# Altium project LDM_POWER_PCB.PrjPcb
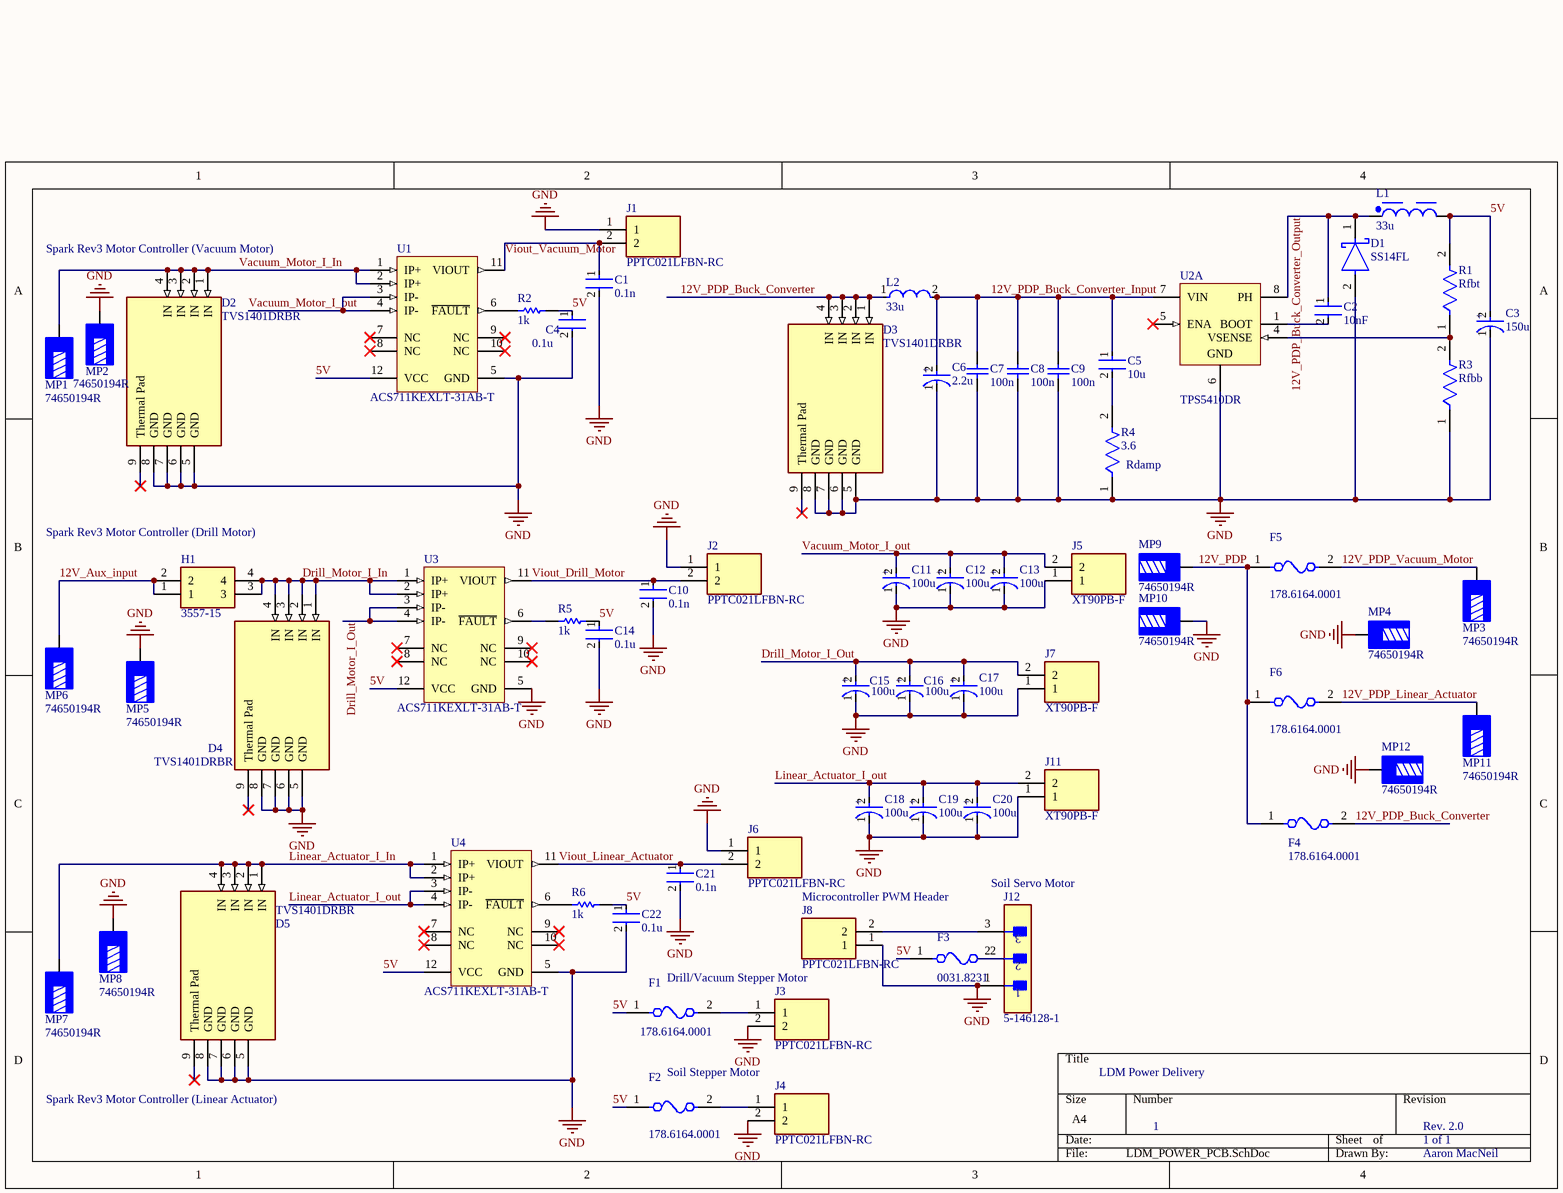
[diagram p0: LDM_POWER_PCB.SchDoc]
1 sheet, 68 parts. Net scope: global (net labels, ports and power ports of the same name join across sheets).
Board file: LDM_POWER_PCB.PcbDoc

## Sheet LDM_POWER_PCB.SchDoc
size A4; SheetNumber: 1; SheetTotal: 1

### Parts
C1  0.1n  [FP-GCM155-0_05-IPC_C]
C2  10nF  [FP-0805-L_2_01_0_2-W_1_25-IPC_A]
C3  150u  [FP-POSCAP-B15G-MFG]
C4  0.1u  [FP-GRM033-0_03-MFG]
C5  10u  [FP-GRM31C-0_2-e0_3_0_8-MFG]
C6  2.2u  [FP-TAJT-MFG]
C7  100n  [CAPC2013X145X48NL20T23]
C8  100n  [CAPC2013X145X48NL20T23]
C9  100n  [CAPC2013X145X48NL20T23]
C10  0.1n  [FP-GCM155-0_05-IPC_C]
C11  100u  [FP-A700X107M12RATE012-MFG]
C12  100u  [FP-A700X107M12RATE012-MFG]
C13  100u  [FP-A700X107M12RATE012-MFG]
C14  0.1u  [FP-GRM033-0_03-MFG]
C15  100u  [FP-A700X107M12RATE012-MFG]
C16  100u  [FP-A700X107M12RATE012-MFG]
C17  100u  [FP-A700X107M12RATE012-MFG]
C18  100u  [FP-A700X107M12RATE012-MFG]
C19  100u  [FP-A700X107M12RATE012-MFG]
C20  100u  [FP-A700X107M12RATE012-MFG]
C21  0.1n  [FP-GCM155-0_05-IPC_C]
C22  0.1u  [FP-GRM033-0_03-MFG]
D1  SS14FL  [FP-425AD-MFG]
D2  TVS1401DRBR  [FP-DRB0008A-MFG]
D3  TVS1401DRBR  [FP-DRB0008A-MFG]
D4  TVS1401DRBR  [FP-DRB0008A-MFG]
D5  TVS1401DRBR  [FP-DRB0008A-MFG]
F1  178.6164.0001  [FP-178_6164_0001-MFG]
F2  178.6164.0001  [FP-178_6164_0001-MFG]
F3  0031.8231  [FP-0031_8231-MFG]
F4  178.6164.0001  [FP-178_6164_0001-MFG]
F5  178.6164.0001  [FP-178_6164_0001-MFG]
F6  178.6164.0001  [FP-178_6164_0001-MFG]
H1  3557-15  [355715]
J1  PPTC021LFBN-RC  [RHDR2W80P0X254_1X2_558X254X850P]
J2  PPTC021LFBN-RC  [RHDR2W80P0X254_1X2_558X254X850P]
J3  PPTC021LFBN-RC  [RHDR2W80P0X254_1X2_558X254X850P]
J4  PPTC021LFBN-RC  [RHDR2W80P0X254_1X2_558X254X850P]
J5  XT90PB-F  [XT90PBF]
J6  PPTC021LFBN-RC  [RHDR2W80P0X254_1X2_558X254X850P]
J7  XT90PB-F  [XT90PBF]
J8  PPTC021LFBN-RC  [RHDR2W80P0X254_1X2_558X254X850P]
J11  XT90PB-F  [XT90PBF]
J12  5-146128-1  [FP-5-146128-1-MFG]
L1  33u  [WE-LQS_6045]
L2  33u  [FP-NR6028-MFG]
MP1  74650194R  [74650194]
MP2  74650194R  [74650194]
MP3  74650194R  [74650194]
MP4  74650194R  [74650194]
MP5  74650194R  [74650194]
MP6  74650194R  [74650194]
MP7  74650194R  [74650194]
MP8  74650194R  [74650194]
MP9  74650194R  [74650194]
MP10  74650194R  [74650194]
MP11  74650194R  [74650194]
MP12  74650194R  [74650194]
R1  Rfbt  [FP-CRCW0402-e3-IPC_B]
R2  1k  [RESC1608X55X30LL15T15]
R3  Rfbb  [FP-CRCW0402-e3-MFG]
R4  3.6  [FP-ESR10-IPC_A]
R5  1k  [RESC1608X55X30LL15T15]
R6  1k  [RESC1608X55X30LL15T15]
U1  ACS711KEXLT-31AB-T  [ALEG-EX-12_V]
U2  TPS5410DR  [D0008A_L]  (part A of 2)
U3  ACS711KEXLT-31AB-T  [ALEG-EX-12_V]
U4  ACS711KEXLT-31AB-T  [ALEG-EX-12_V]

### Nets
GND: C1.2 C3.1(C) C4.2 C6.1(C) C7.1 C8.1 C9.1 C10.2 C11.1(C) C12.1(C) C13.1(C) C14.2 C15.1(C) C16.1(C) C17.1(C) C18.1(C) C19.1(C) C20.1(C) C21.2 C22.2 D1.2(A) D2.5(GND) D2.6(GND) D2.7(GND) D2.8(GND) D3.5(GND) D3.6(GND) D3.7(GND) D3.8(GND) D4.5(GND) D4.6(GND) D4.7(GND) D4.8(GND) D5.5(GND) D5.6(GND) D5.7(GND) D5.8(GND) J1.1 J2.1 J3.2 J4.2 J5.1 J6.1 J7.1 J8.1 J11.1 J12.1 MP2.1 MP4.1 MP5.1 MP8.1 MP10.1 MP12.1 R3.1 R4.1 U1.5(GND) U2.6(GND) U3.5(GND) U4.5(GND)
5V: C3.2(A) C4.1 C14.1 C22.1 F1.1 F2.1 F3.1 L1.2 R1.2 R2.2 R5.2 R6.2 U1.12(VCC) U3.12(VCC) U4.12(VCC)
12V_Aux_input: H1.1 H1.2 MP6.1
12V_PDP: F4.1 F5.1 F6.1 MP9.1
12V_PDP_Buck_Converter: D3.1(IN) D3.2(IN) D3.3(IN) D3.4(IN) F4.2 L2.1
12V_PDP_Buck_Converter_Input: C5.1 C6.2(A) C7.2 C8.2 C9.2 L2.2 U2.7(VIN)
12V_PDP_Buck_Converter_Output: C2.1 D1.1(C) L1.1 U2.8(PH)
12V_PDP_Linear_Actuator: F6.2 MP11.1
12V_PDP_Vacuum_Motor: F5.2 MP3.1
Drill_Motor_I_In: D4.1(IN) D4.2(IN) D4.3(IN) D4.4(IN) H1.3 H1.4 U3.1(IP+) U3.2(IP+)
Drill_Motor_I_Out: C15.2(A) C16.2(A) C17.2(A) J7.2 U3.3(IP-) U3.4(IP-)
Linear_Actuator_I_In: D5.1(IN) D5.2(IN) D5.3(IN) D5.4(IN) MP7.1 U4.1(IP+) U4.2(IP+)
Linear_Actuator_I_out: C18.2(A) C19.2(A) C20.2(A) J11.2 U4.3(IP-) U4.4(IP-)
Vacuum_Motor_I_In: D2.1(IN) D2.2(IN) D2.3(IN) D2.4(IN) MP1.1 U1.1(IP+) U1.2(IP+)
Vacuum_Motor_I_out: C11.2(A) C12.2(A) C13.2(A) J5.2 U1.3(IP-) U1.4(IP-)
Viout_Drill_Motor: C10.1 J2.2 U3.11(VIOUT)
Viout_Linear_Actuator: C21.1 J6.2 U4.11(VIOUT)
Viout_Vacuum_Motor: C1.1 J1.2 U1.11(VIOUT)
NetC2_2: C2.2 U2.1(BOOT)
NetC5_2: C5.2 R4.2
NetF1_2: F1.2 J3.1
NetF2_2: F2.2 J4.1
NetF3_2: F3.2 J12.2
NetJ8_2: J8.2 J12.3
NetR1_1: R1.1 R3.2 U2.4(VSENSE)
NetR2_1: R2.1 U1.6(~{FAULT})
NetR5_1: R5.1 U3.6(~{FAULT})
NetR6_1: R6.1 U4.6(~{FAULT})

Not connected (* = marked no-connect by the designer): D2 9(Thermal_Pad)*; D3 9(Thermal_Pad)*; D4 9(Thermal_Pad)*; D5 9(Thermal_Pad)*; U1 7(NC)* 8(NC)* 9(NC)* 10(NC)*; U2 5(ENA)*; U3 7(NC)* 8(NC)* 9(NC)* 10(NC)*; U4 7(NC)* 8(NC)* 9(NC)* 10(NC)*

### Notes on the sheet
- (near D2) Spark Rev3 Motor Controller (Vacuum Motor)
- (near R4) Rdamp
- (near H1) Spark Rev3 Motor Controller (Drill Motor)
- (near J8) Microcontroller PWM Header
- (near J12) Soil Servo Motor
- Drill/Vacuum Stepper Motor
- Soil Stepper Motor
- LDM Power Delivery
- Spark Rev3 Motor Controller (Linear Actuator)
- 1
- Rev. 2.0
- 1 of 1
- Aaron MacNeil
- (in symbol CMP-03016-000017-1) +
- (in symbol CMP-04424-000626-1) +
- (in symbol CMP-05428-000197-1) +

### Library data of the parts
C1 C10 C21 = CMP-2008-03694-3: Ceramic Capacitor for Automotive 100pF ±5% 50VDC C0G 0402 Paper T/R; Voltage: 50V; Ratings: AEC-Q200; Radiation Hardening: No; Min Operating Temperature: -55°C; Capacitance: 100pF; Depth: 0.5mm; Max Operating Temperature: 125°C; Length: 1mm; Height: 0.5mm; Termination: SMD/SMT; Voltage Rating: 50V; Dielectric: C0G; Package Quantity: 10000; Case Code (Imperial): 0402; Width: 0.02inch; Case/Package: 0402; Lead Free: Lead Free; Case Code (Metric): 1005; Voltage Rating (DC): 50V; Thickness: 0.022inch; Mount: Surface Mount; Tolerance: 5%; REACH SVHC: No SVHC; Weight: 0.000212oz; Packaging: Tape and Reel
C2 = CMP-2000-05015-2: General Purpose Ceramic Capacitor, 0805, 10nF, 10%, X7R, 0.15, 50V; Dissipation Factor: 2.5%; Insulation Resistance: 100GR; Capacitance: 10nF; Case/Package: 0805; Tolerance: 10%; Number of Pins: 2; Thickness: 0.037inch; RoHS Compliant: Yes; Width: 1.25mm; Voltage: 50V; Lead Free: Lead Free; Voltage Rating: 50V; Termination: SMD/SMT; Dielectric Material: Ceramic; Dielectric: X7R; Radiation Hardening: No; Package Quantity: 1; Case Code (Metric): 2012; Max Operating Temperature: 125°C; Voltage Rating (DC): 50V; Depth: 1.25mm; REACH SVHC: No SVHC; Case Code (Imperial): 0805; Min Operating Temperature: -55°C; Packaging: Tape and Reel; Mount: Surface Mount; Length: 2.01mm; Height: 0.94mm; Contact Plating: Tin
C3 = CMP-05428-000197-1: Molded Tantalum Polymer Capacitor 150uF 20% 6.3V life 1000Hours SMD 1411; Leakage Current: 94.5uA; Dissipation Factor: 10%; Polarity: Polar; ESR (Equivalent Series Resistance): 70mR; Ripple Current: 1A; Voltage Rating: 6.3V; Case Code (Metric): 3528; Case/Package: Molded; Height - Seated (Max): 0.059inch; Width: 2.8mm; Tolerance: 20%; Min Operating Temperature: -55°C; Length: 3.5mm; Features: General Purpose; Lead Free: Lead Free; REACH SVHC: No SVHC; Max Operating Temperature: 105°C; Case Code (Imperial): 1210; Series: POSCAP™ TPG; Depth: 2.8mm; Capacitance: 150uF; Packaging: Tape and Reel; Radiation Hardening: No; Voltage Rating (DC): 6.3V; Termination: SMD/SMT; Construction: Flat; Voltage: 6.3V; Package Quantity: 2500; Mount: Surface Mount; Height: 1.4mm; RoHS Compliant: Yes
C4 C14 C22 = CMP-06035-000062-2: Chip Multilayer Ceramic Capacitors for General Purpose, 0201, 0.10uF, X5R, 15%, 10%, 6.3V; Capacitance: 100nF; Min Operating Temperature: -55°C; Lead Free: Lead Free; Radiation Hardening: No; Dielectric: X5R; Voltage Rating (DC): 6.3V; REACH SVHC: No SVHC; Case/Package: 0201; Voltage Rating: 6.3V; Length: 0.6mm; Max Operating Temperature: 85°C; Width: 0.012inch; Depth: 0.3mm; Material: Ceramic; Case Code (Metric): 0603; Thickness: 0.013inch; Packaging: Tape and Reel; Height: 0.3mm; Weight: 6E-06oz; Package Quantity: 1; Mount: Surface Mount; Voltage: 6.3V; Case Code (Imperial): 0201; Tolerance: 10%; Termination: SMD/SMT
C5 = CMP-06035-003589-1: Chip Multilayer Ceramic Capacitors for General Purpose, 1206, 10uF, X7R, 15%, 10%, 25V; Case Code (Imperial): 1206; Voltage Rating (DC): 25V; Voltage Rating: 25V; Length: 3.2mm; Lead Free: Lead Free; Thickness: 0.071inch; Package Quantity: 1; Width: 1.6mm; Max Operating Temperature: 125°C; Number of Pins: 2; Height: 1.6mm; Case Code (Metric): 3216; REACH SVHC: No SVHC; Radiation Hardening: No; Case/Package: 1206; Material: Ceramic; Tolerance: 10%; Voltage: 25V; Mount: Surface Mount; Packaging: Tape and Reel; Dielectric: X7R; Termination: SMD/SMT; Min Operating Temperature: -55°C; Capacitance: 10uF; Depth: 1.6mm
C6 = CMP-04424-000626-1: 2.2uF 25V  ±10% 4.5Ω 1210  SMD Tantalum Capacitor; Dissipation Factor: 6%; Polarity: Polar; Leakage Current: 600nA; ESR (Equivalent Series Resistance): 4.5R; Construction: Flat; Case Code (Imperial): 1210; Lead Free: Lead Free; RoHS Compliant: Yes; Length: 3.5mm; Voltage Rating: 25V; Mount: Surface Mount; Capacitance: 2.2uF; Case/Package: 1210; Number of Pins: 2; Voltage Rating (DC): 25V; Package Quantity: 2500; Height - Seated (Max): 0.047inch; Min Operating Temperature: -55°C; Max Operating Temperature: 125°C; REACH SVHC: No SVHC; Weight: 0.000564oz; Depth: 2.8mm; Series: TAJ; Lead Pitch: 1.4mm; Height: 1.2mm; Case Code (Metric): 3528; Dielectric Material: Tantalum; Termination: SMD/SMT; Packaging: Tape and Reel; Width: 2.8mm; Features: General Purpose; Tolerance: 10%; Radiation Hardening: No
C7-C9 = CMP-2007-03172-1: Manufacturer: Vitramon; Part Number: VJ0805Y104KXXAT
C11-C13 C15-C20 = CMP-03016-000017-1: ALU POLY SMD 7343 100UF 20% 12.5; Ripple Current: 4.3A; ESR (Equivalent Series Resistance): 12mR; Max Operating Temperature: 125°C; Contact Plating: Tin; Length: 7.3mm; Mount: Surface Mount; Min Operating Temperature: -55°C; Tolerance: 20%; Termination: J-Lead; Case/Package: 2917; Capacitance: 100uF; RoHS Compliant: Yes
D1 = CMP-07162-000013-1: DIODE SCHOTTKY 40V 1A SOD123F; Manufacturer: ON Semiconductor; Max Junction Temp: +125°C; Value: 60pF; Max Surge Forward Current: 40A; Peak Reverse Current: 30uA; Device Class L3: Schottky Diodes; Reverse Voltage: 40V; Automotive: No; Temperature: -55°C to +125°C; Mouser Description: SS14FL Series 40 V 1 A Surface Mount Schottky Barrier Rectifier - SOD-123F; Octopart: https://octopart.com/ss14fl-on+semiconductor-84331601; Height: 1.08mm; Temperature Range Low: -55°C; Category: Diode; Lead Free: Yes; Device Class L1: Discrete Semiconductors; Digikey Description: DIODE SCHOTTKY 40V 1A SOD123F; RoHS: TRUE; ComponentLink2Description: Datasheet; Manufacturer Part Number: SS14FL; Forward Current: 1A; Capacitance: 60pF; Package: 425AD; Device Class L2: Diodes; Temperature Range High: +125°C; Max Repetitive Reverse Voltage: 40V; ComponentLink2URL: https://www.onsemi.com/pub/Collateral/SS14FL-D.PDF
D2-D5 = CMP-04985-000021-1: IC UNIDIR PRECISION SURGE DIODE; RoHS Compliant: Yes
F1 F2 F4-F6 = CMP-08604-000013-1: FUSE HOLDER BLADE 80V PCB; Manufacturer: Littelfuse Inc; Number Of Fuses: 1; Conn Orientation: Vertical; Package: 0; Device Class L1: Circuit Protection; Category: Fuse; Digikey Description: FUSE HOLDER BLADE 80V PCB; RoHS: TRUE; ComponentLink2Description: Datasheet; ComponentLink2URL: https://www.littelfuse.com/~/media/commercial-vehicle/datasheets/automotive-fuse-holders/ato/littelfuse-fuse-holder-ato-flr-pcb-datasheet.pdf; Temperature Range High: +130°C; Lead Free: Yes; Voltage Rating Ac: 80V; Mouser Description: Fuse Holder HOLDER FOR FLR (ATO) PCB 1-PIN; Manufacturer Part Number: 178.6164.0001; Height: 17.5mm; Device Class L3: unset; Octopart: https://octopart.com/178.6164.0001-littelfuse-44502275; Automotive: No; Voltage Rating Dc: 80V; Device Class L2: Fuse Holders; Temperature: to +130°C
F3 = CMP-26292-000005-1: FUSE BLOK CARTRIDGE 600V 16A PCB; Manufacturer: Schurter; Voltage Rating Ac: 500V; Number Of Fuses: 1; Standoff Height: 0.7mm; Conn Orientation: Horizontal; ComponentLink2URL: https://www.schurter.com/en/datasheet/typ_OGD.pdf; Voltage Rating Dc: 600V; Package: 0; Device Class L3: unset; Digikey Description: FUSE BLOK CARTRIDGE 600V 16A PCB; Mouser Description: Fuse Holder OGD FUSEHOLDER 5X20/6.3X32; Category: Fuse; Device Class L2: Fuse Holders; Height: 12.7mm; ComponentLink2Description: Datasheet; Ambient Temperature Range Low: -40°C; Ambient Temperature Range High: +85°C; Octopart: https://octopart.com/0031.8231-schurter-8659; Automotive: No; RoHS: TRUE; Fuse Current: 16A; Lead Free: Yes; Device Class L1: Circuit Protection; Manufacturer Part Number: 0031.8231
H1 = 3557-15: Hardware; Manufacturer_Name: Keystone Electronics; Datasheet Link: https://www.keyelco.com/product-pdf.cfm?p=14225; Height: 7.5mm; Manufacturer_Part_Number: 3557-15; Mouser Part Number: 534-3557-15; Mouser Price/Stock: https://www.mouser.co.uk/ProductDetail/Keystone-Electronics/3557-15?qs=iR2ablhfrmFh8obBV91Xhg%3D%3D
J1-J4 J6 J8 = PPTC021LFBN-RC: Connector; Manufacturer_Name: Sullins; Datasheet Link: http://www.sullinscorp.com/drawings/78_P(N)PxCxxxLFBN-RC,_10492-H.pdf; Height: 8.5mm; Manufacturer_Part_Number: PPTC021LFBN-RC
J5 J7 J11 = XT90PB-F: Connector; Manufacturer_Name: Amass; Datasheet Link: https://www.china-amass.com/biao/439.html; Height: 19.7mm; Manufacturer_Part_Number: XT90PB-F
J12 = CMP-03369-000030-1: CONN HEADER SMD 3POS 2.54MM; Manufacturer: TE; Conn Gender: Male; Number Of Contacts: 3; Current Rating: 3A; Conn Orientation: Straight; Voltage Rating: 30V; Temperature Range Low: -65°C; Device Class L1: Connectors; Mouser Description: AMPMODU 3 Position Surface Mount Single Row Straight 2.54 mm Breakaway Header; Automotive: No; Temperature Range High: +125°C; Temperature: -65°C to +125°C; Device Class L2: Headers and Wire Housings; Pitch: 2.54mm; ComponentLink2Description: Datasheet; Category: Conn; Digikey Description: CONN HEADER SMD 3POS 2.54MM; ComponentLink2URL: https://www.te.com/global-en/product-5-146128-1.html; Contact Material: Gold,Nickel; Device Class L3: unset; Package: HDR3; Footprint Url: https://www.te.com/commerce/DocumentDelivery/DDEController?Action=srchrtrv&DocNm=146128&DocType=Customer+Drawing&DocLang=English; Octopart: https://octopart.com/5-146128-1-te+connectivity-40948200; Number Of Rows: 1; Height: 10.1092mm; Manufacturer Part Number: 5-146128-1; RoHS: TRUE; Lead Free: Yes
L1 = CMP-1354-00075-2: NexarPartId: 46948302; Tolerance: 20%; Test Frequency: 100kHz; Inductance: 33µH; Saturation Current: 1.8A; DC Resistance (DCR): 137mΩ; Max DC Current: 1.45A; Self Resonant Frequency: 12MHz; Series Resistance: 178.1mΩ; Shielding: Shielded; Core Material: Ferrite; Case/Package: Nonstandard; Mount: Surface Mount; Width: 6mm; Packaging: Tape & Reel (TR); Height: 4.5mm; Length: 6mm; REACH SVHC: Unknown; RoHS: Compliant; Min Operating Temperature: -40°C; Height - Seated (Max): 4.4958mm; Inductance Tolerance: 20%; Current Rating: 1.8A; Max Operating Temperature: 125°C; Ambient Temperature Range Low: -40°C; Ambient Temperature Range High: 85°C; RMS Current (Irms): 1.45A; Composition: Wirewound; Termination: SMD/SMT
L2 = CMP-14484-001265-1: SMD Power Inductors 33uH ±20% 1.1A 0.286Ω; Self Resonant Frequency: 10MHz; DC Resistance (DCR): 286mR; Shielding: Shielded; Test Frequency: 100kHz; Core Material: Ferrite; Case/Package: 6028; RMS Current (Irms): 1.1A; Packaging: Tape and Reel; Lead Free: Lead Free; Min Operating Temperature: -25°C; Inductance: 33uH; Tolerance: 20%; RoHS Compliant: Yes; Current Rating: 1.1A; Max Operating Temperature: 125°C; Number of Pins: 2; Termination: SMD/SMT; Resistor Type: Wirewound; Package Quantity: 2000; Height: 2.8mm; Width: 0.236inch; Radiation Hardening: No; Halogen Free: Halogen Free; Depth: 6.2mm; Length: 6mm; Series: NRS; Height - Seated (Max): 0.11inch; Max DC Current: 1.1A; Inductance Tolerance: 20%; Saturation Current: 1.1A; Mount: Surface Mount
MP1-MP12 = CMP-03913-78872230-1: 74650194R Bush, THR, internal blind-hole thread, 10 mm W x 7 mm H, M4, 9 Pins; Current Rating: 85A; Height: 4mm; Number of Pins: 9; Width: 10mm; Max Operating Temperature: 150°C; Material: Brass; Min Operating Temperature: -55°C; NexarPartId: 78872230; Packaging: Tape and Reel; RoHS: Compliant
R1 = CMP-2002-08135-2: RES SMD 10K OHM 1% 1/16W 0402; Power Rating: 63mW; Resistance: 10kR; Voltage Rating: 50V; Temperature Coefficient: 100ppm/°C; Case Code (Metric): 1005; Features: Automotive AEC-Q200; Termination: SMD/SMT; Mount: Surface Mount; Package Quantity: 10; Packaging: Tape and Reel; Case Code (Imperial): 0402; Weight: 2.3E-05oz; Lead Free: Lead Free; Width: 0.02inch; Max Power Dissipation: 63mW; Tolerance: 1%; Number of Terminations: 2; Height: 0.35mm; Number of Pins: 2; Composition: Thick Film; Length: 1mm; Voltage Rating (DC): 50V; Case/Package: 0402; Radiation Hardening: No; Contact Plating: Tin; Depth: 0.5mm; Military Standard: Not; Min Operating Temperature: -55°C; Max Operating Temperature: 155°C
R2 R5 R6 = CMP-2000-00180-1: Part Number: ERJ-3EKF1001V; Manufacturer: Panasonic
R3 = CMP-2002-08579-2: RES Thick Film, 3.24kΩ, 1%, 0.063W, 100ppm/°C, 0402; Voltage Rating: 50V; Max Power Dissipation: 63mW; Resistance: 3.24kR; Packaging: Tape and Reel; Composition: Thick Film; Depth: 0.5mm; Weight: 2.3E-05oz; Number of Terminations: 2; Radiation Hardening: No; Voltage Rating (DC): 50V; Tolerance: 1%; Lead Free: Lead Free; Case Code (Metric): 1005; Height: 0.35mm; Temperature Coefficient: 100ppm/°C; Width: 0.5mm; Max Operating Temperature: 155°C; Mount: Surface Mount; Package Quantity: 10; Number of Pins: 2; Min Operating Temperature: -55°C; Features: Automotive AEC-Q200; Case Code (Imperial): 0402; Power Rating: 63mW; Military Standard: Not; Contact Plating: Tin; Length: 1mm; Case/Package: 0402; Termination: SMD/SMT
R4 = CMP-08839-028824-1: 3.6Ω ±5% 0.4W 0805 Anti-Surge Chip Resistor AEC-Q200; Temperature Coefficient: 200ppm/°C; Resistance: 3.6R; Max Power Dissipation: 400mW; Max Operating Temperature: 155°C; Height: 0.026inch; Tolerance: 5%; Case Code (Metric): 2012; Number of Terminations: 2; Features: Automotive AEC-Q200; Width: 0.049inch; Length: 0.079inch; Min Operating Temperature: -55°C; Package Quantity: 5000; Resistor Type: Thick Film; Case/Package: 0805; RoHS Compliant: Yes; Packaging: Tape and Reel; Series: ESR; Case Code (Imperial): 0805
U1 U3 U4 = CMP-1557-00002-1: Hall Effect Linear Current Sensor with Overcurrent Fault Output for <100 V Isolation Applications, 3 to 5.5 V, -31 to 31 A IP, -40 to 125 degC, 12-Pin QFN (EX), RoHS, Tape and Reel; IP Max: 31 A; VCC Min: 3 V; -3dB Bandwidth: 0.1 MHz; VCC Max: 5.5 V; IP Min: -31 A; Mounting Technology: Surface Mount; DatasheetVersion: Rev. 3; Temperature Min: -40 degC; ComponentLink1Description: Manufacturer URL; Packing: Tape and Reel; PartNumber: ACS711KEXLT-31AB-T; Temperature Max: 125 degC; ComponentLink2Description: Datasheet; ComponentLink3Description: Package Specification; RoHS: TRUE; ComponentLink1URL: http://www.allegromicro.com/; ComponentLink2URL: http://www.allegromicro.com/~/media/Files/Datasheets/ACS711-Datasheet.ashx?la=en; PackageDescription: 12-Pin Quad Flat No-Lead, Body 3 x 3 mm, Height 0.8 mm; ComponentLink3URL: http://www.allegromicro.com/~/media/Files/Datasheets/ACS711-Datasheet.ashx?la=en
U2 = CMP-0323-00174-3: Buck Step Down Regulator with 5.5 to 36 V Input and 1.23 to 31 V Output, -40 to 125 degC, 8-Pin SOIC (D), Green (RoHS & no Sb/Br); Manufacturer: Texas Instruments; Vout(Min)(V): 1.23; Regulated Outputs(#): 1; Duty Cycle(Max)(%): 87.5; SubFamily: Step-Down Regulator; Switch Current Limit(Typ)(A): 1.2; Vin(Min)(V): 5.5; Iq(Typ)(mA): 3; Vout(Max)(V): 31; Vin(Max)(V): 36; Rating: Catalog; ComponentLink2Description: Package Specification; PackageDescription: 8-Pin Plastic Small Outline Integrated Circuit, 4.9 x 3.9 mm, Pitch 1.27 mm Pitch; Code_JEDEC: MS-012AA; DatasheetVersion: SLVS675A; Topology: Buck; ComponentLink2URL: http://www.ti.com/litv/pdf/msoi002j; PackageReference: D0008A; Mounting Technology: Surface Mount; Iout(Max)(A): 1; PackageVersion: revM, Jun-2011; ComponentLink1Description: Datasheet; Eco-Plan: Green (RoHS & no Sb/Br); ComponentLink1URL: http://www.ti.com/general/docs/lit/getliterature.tsp?genericPartNumber=TPS5410&fileType=pdf; ComponentLink3Description: URL Link1; ComponentLink3URL: Samples URL:http://www.ti.com/product/tps5410#samples; PartNumber: TPS5410DR